# EAGLE design Modulador e Demodulador AM (EAGLE 7.6.0)
CNAME: Principios de Telecomunicacao; CREVISION: REV1; DESIGNER: F. Carrion, M. Silva
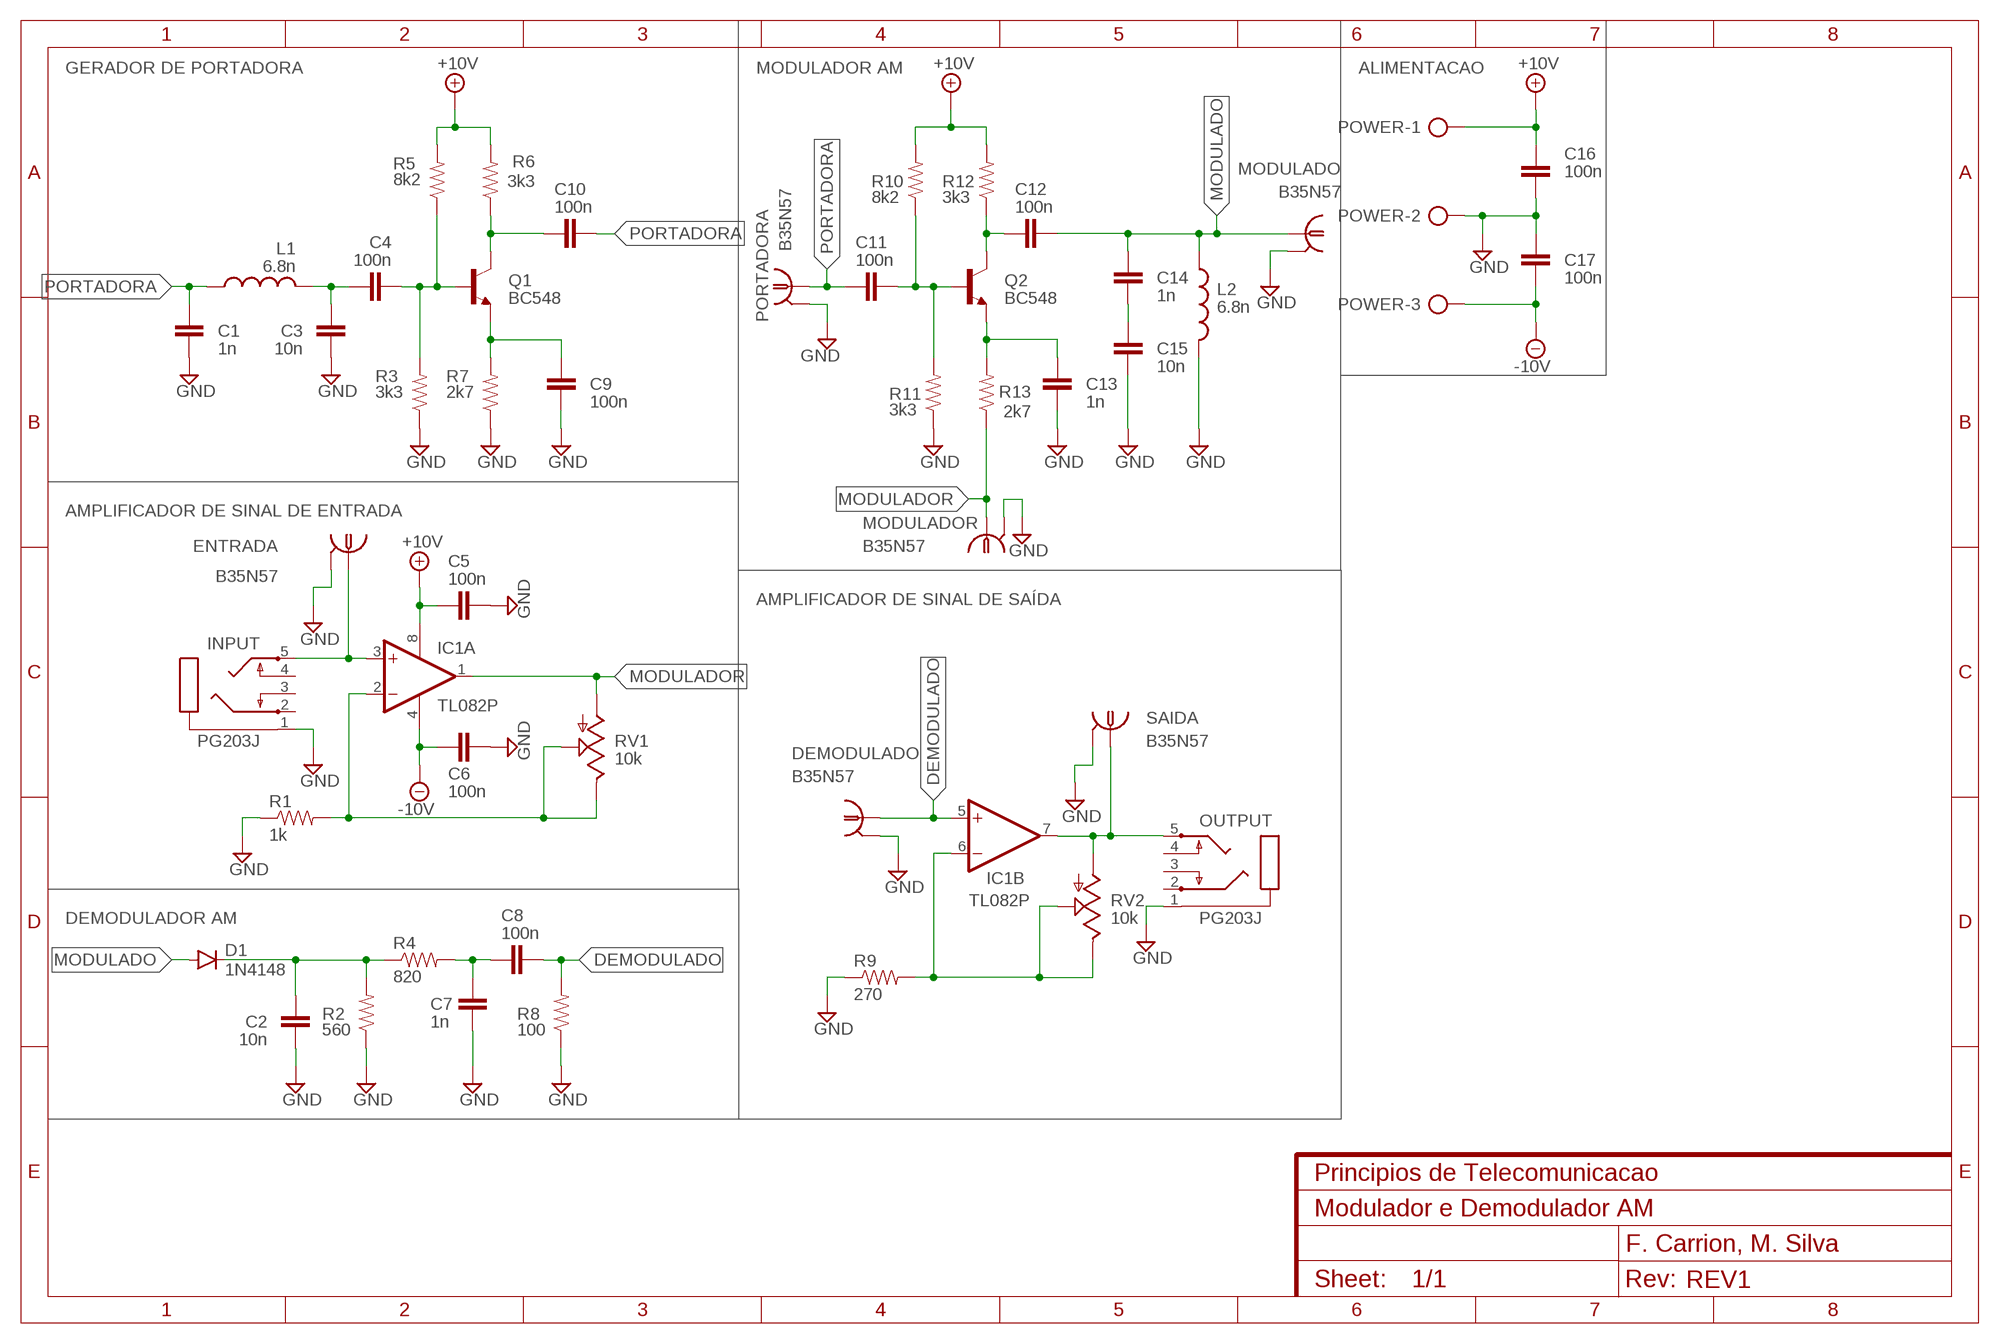
[diagram p0: schematic, sheet 1]

## Parts
C1  1n  CAPPTH2  [CAP-PTH-SMALL2]
C2  10n  CAPPTH2  [CAP-PTH-SMALL2]
C3  10n  CAPPTH2  [CAP-PTH-SMALL2]
C4  100n  CAPPTH2  [CAP-PTH-SMALL2]
C5  100n  CAPPTH2  [CAP-PTH-SMALL2]
C6  100n  CAPPTH2  [CAP-PTH-SMALL2]
C7  1n  CAPPTH2  [CAP-PTH-SMALL2]
C8  100n  CAPPTH2  [CAP-PTH-SMALL2]
C9  100n  CAPPTH2  [CAP-PTH-SMALL2]
C10  100n  CAPPTH2  [CAP-PTH-SMALL2]
C11  100n  CAPPTH2  [CAP-PTH-SMALL2]
C12  100n  CAPPTH2  [CAP-PTH-SMALL2]
C13  1n  CAPPTH2  [CAP-PTH-SMALL2]
C14  1n  CAPPTH2  [CAP-PTH-SMALL2]
C15  10n  CAPPTH2  [CAP-PTH-SMALL2]
C16  100n  CAPPTH2  [CAP-PTH-SMALL2]
C17  100n  CAPPTH2  [CAP-PTH-SMALL2]
D1  1N4148  DIODE1N4148  [DIODE-1N4148]
DEMODULADO  B35N57  [B35N57]
ENTRADA  B35N57  [B35N57]
IC1  TL082P  [DIL08]
INPUT  PG203J  [PG203J]
L1  6.8n  L-US0207/10  [0207/10]
L2  6.8n  L-US0207/10  [0207/10]
MODULADO  B35N57  [B35N57]
MODULADOR  B35N57  [B35N57]
OUTPUT  PG203J  [PG203J]
PORTADORA  B35N57  [B35N57]
POWER  AK500/3-H  [AK500/3-H]
Q1  BC548  [TO92-EBC]
Q2  BC548  [TO92-EBC]
R1  1k  RESISTORAXIAL-0.3  [AXIAL-0.3]
R2  560  RESISTORAXIAL-0.3  [AXIAL-0.3]
R3  3k3  RESISTORAXIAL-0.3  [AXIAL-0.3]
R4  820  RESISTORAXIAL-0.3  [AXIAL-0.3]
R5  8k2  RESISTORAXIAL-0.3  [AXIAL-0.3]
R6  3k3  RESISTORAXIAL-0.3  [AXIAL-0.3]
R7  2k7  RESISTORAXIAL-0.3  [AXIAL-0.3]
R8  100  RESISTORAXIAL-0.3  [AXIAL-0.3]
R9  270  RESISTORAXIAL-0.3  [AXIAL-0.3]
R10  8k2  RESISTORAXIAL-0.3  [AXIAL-0.3]
R11  3k3  RESISTORAXIAL-0.3  [AXIAL-0.3]
R12  3k3  RESISTORAXIAL-0.3  [AXIAL-0.3]
R13  2k7  RESISTORAXIAL-0.3  [AXIAL-0.3]
RV1  10k  POT-RV16AF-20  [POT_ALPHA_RV16AF-20]
RV2  10k  POT-RV16AF-20  [POT_ALPHA_RV16AF-20]
SAIDA  B35N57  [B35N57]

## Nets
+10V: C5.1 C16.1 IC1.8(P:V+) POWER.1 R5.P$2 R6.P$2 R10.P$2 R12.P$2
-10V: C6.1 C17.2 IC1.4(P:V-) POWER.3
DEMODULADO: C8.2 DEMODULADO.1 IC1.5(B:+IN) R8.P$2
GND: C1.2 C2.2 C3.2 C5.2 C6.2 C7.2 C9.2 C13.2 C15.2 C16.2 C17.1 DEMODULADO.2 DEMODULADO.3 DEMODULADO.4 DEMODULADO.5 ENTRADA.2 ENTRADA.3 ENTRADA.4 ENTRADA.5 INPUT.1 L2.2 MODULADO.2 MODULADO.3 MODULADO.4 MODULADO.5 MODULADOR.2 MODULADOR.3 MODULADOR.4 MODULADOR.5 OUTPUT.1 PORTADORA.2 PORTADORA.3 PORTADORA.4 PORTADORA.5 POWER.2 R1.P$1 R2.P$1 R3.P$1 R7.P$1 R8.P$1 R9.P$1 R11.P$1 SAIDA.2 SAIDA.3 SAIDA.4 SAIDA.5
MODULADO: C12.2 C14.1 D1.A L2.1 MODULADO.1
MODULADOR: IC1.1(A:OUT) MODULADOR.1 R13.P$1 RV1.1(A)
N$1: C11.2 Q2.B R10.P$1 R11.P$2
N$2: IC1.2(A:-IN) R1.P$2 RV1.2(S) RV1.3(E)
N$3: C9.1 Q1.E R7.P$2
N$4: C4.2 Q1.B R3.P$2 R5.P$1
N$5: C10.1 Q1.C R6.P$1
N$6: IC1.6(B:-IN) R9.P$2 RV2.2(S) RV2.3(E)
N$7: C12.1 Q2.C R12.P$1
N$8: ENTRADA.1 IC1.3(A:+IN) INPUT.5
N$9: C13.1 Q2.E R13.P$2
N$10: C3.1 C4.1 L1.2
N$11: C14.2 C15.1
N$12: C2.1 D1.C R2.P$2 R4.P$1
N$13: C7.1 C8.1 R4.P$2
N$15: IC1.7(B:OUT) OUTPUT.5 RV2.1(A) SAIDA.1
PORTADORA: C1.1 C10.2 C11.1 L1.1 PORTADORA.1
Unconnected: INPUT.2 INPUT.3 INPUT.4 OUTPUT.2 OUTPUT.3 OUTPUT.4

## Notes on the sheet
- GERADOR DE PORTADORA | MODULADOR AM | ALIMENTACAO
- AMPLIFICADOR DE SINAL DE ENTRADA
- AMPLIFICADOR DE SINAL DE SAÍDA
- DEMODULADOR AM

## Library data of the parts
C1-C17 = SparkFun-Capacitors:CAP: Capacitor Standard 0603 ceramic capacitor, and 0.1" leaded capacitor.
D1 = SparkFun-DiscreteSemi:DIODE: Diode These are standard reverse protection diodes and small signal diodes. SMA package can handle up to about 1A. SOD-323 can handle about 200mA. What the SOD-323 package when ordering, there are some mfgs out there that are 5-pin packages.; PROD_ID: DIO-08378
DEMODULADO ENTRADA MODULADO MODULADOR PORTADORA SAIDA = con-coax:B35N57: BNC CONNECTOR M/A COM www.macom.com; OC_FARNELL: unknown; OC_NEWARK: unknown
IC1 = linear:TL082: OP AMP Data sheet <http://www.ti.com/lit/ds/symlink/tl084a . pdf>; DATA_SHEET: <a href="http://www.ti.com/lit/ds/symlink/tl084a.pdf"> Data sheet </a>
INPUT OUTPUT = con-hirschmann:PG203J: MIC/HEADPHONE JACK KS-S stereo microphone/headphone jack PG203JN (Schukat); OC_FARNELL: unknown; OC_NEWARK: unknown
L1 L2 = resistor:L-US: INDUCTOR, American symbol
POWER = con-ptr500:AK500/3-H: CONNECTOR Aug. 2004 / PTR Meßtechnik: Die Bezeichnung der Serie AK505 wurde geändert. Es handelt sich hierbei um AK500 in horizontaler Ausführung.; OC_FARNELL: unknown; OC_NEWARK: unknown
Q1 Q2 = transistor-npn:BC548*: NPN Transistor
R1-R13 = SparkFun-Resistors:RESISTOR: Resistor Basic schematic elements and footprints for 0603, 1206, and PTH resistors.
RV1 RV2 = SparkFun-Electromechanical:POT

## Board
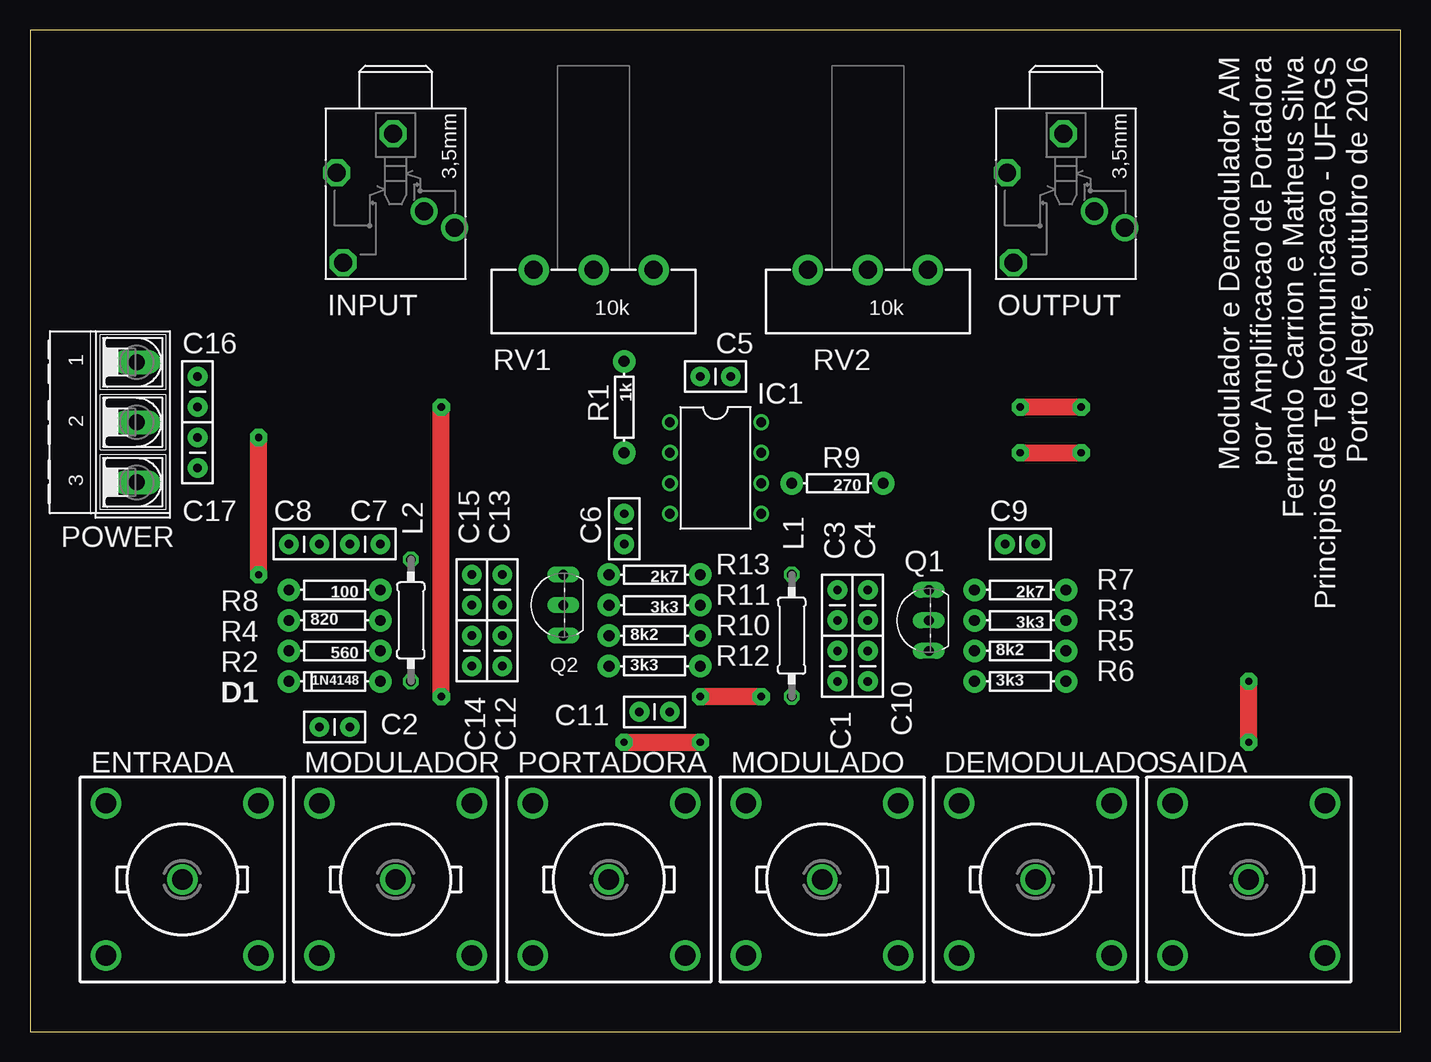
[diagram p1: board, top side]
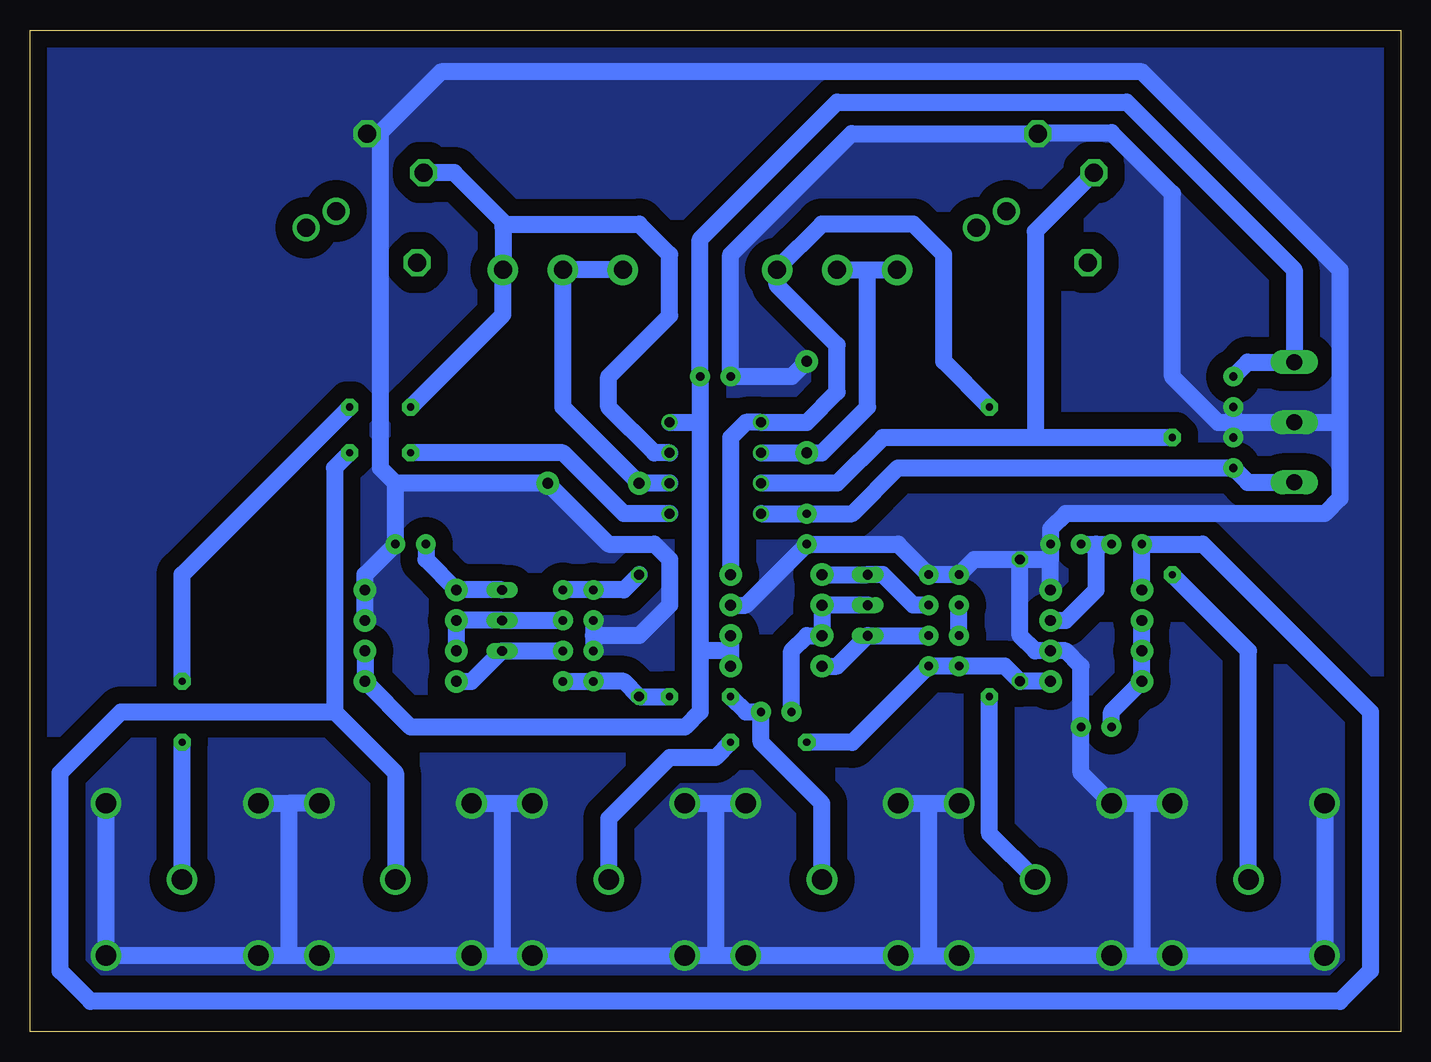
[diagram p2: board, bottom side, seen from below]

Size 114.28 x 83.49 mm. Coordinates in mm from the lower left corner, seen from the top.
Outline: 0,0 114.28,0 114.28,83.49 0,83.49 0,0
Copper layers (1*16): Top 0.035mm / dielectric 1.5mm / Bottom 0.035mm
Design rules "default": minimum track width 10mil, minimum drill 24mil, track to track 8mil, track to pad 8mil, pad to pad 8mil, via to via 8mil, smd to smd 8mil, copper to edge 40mil, drill to drill 8mil, minimum pad ring 10mil, minimum via ring 8mil, stop-mask expansion 4mil, vias tented up to drill 0mil, thermal gap 10mil

### Footprints (pad centres in the part's own frame; a part is rotated, then mirrored left to right if it is on the bottom)
CAP-PTH-SMALL2 = drill 0.7 pad 1.651: 1 0,0; 2 2.54,0
DIODE-1N4148 = drill 0.9 pad 1.88: A -3.81,0; C 3.81,0
B35N57 = drill 1.7: 1 0,0; 2 6.35,6.35; 3 -6.35,6.35; 4 -6.35,-6.35; 5 6.35,-6.35
DIL08 = drill 0.813 pad 1.27: 1 -3.81,-3.81; 2 -1.27,-3.81; 3 1.27,-3.81; 4 3.81,-3.81; 5 3.81,3.81; 6 1.27,3.81; 7 -1.27,3.81; 8 -3.81,3.81
PG203J = drill 1.499 octagon: 1 -5.004,-0.203; 4 5.74,-4.369; 5 -1.753,-4.902 | drill 1.499: 2 2.845,4.902; 3 1.448,2.388
0207/10 = drill 0.813 octagon: 1 -5.08,0; 2 5.08,0
AK500/3-H = drill 1.321 long: 1 -5.004,0; 2 0,0; 3 5.004,0
TO92-EBC = drill 0.813 long: B 0,-1.27; C -2.54,-1.27; E 2.54,-1.27
AXIAL-0.3 = drill 0.9 pad 1.88: P$1 -3.81,0; P$2 3.81,0
POT_ALPHA_RV16AF-20 = drill 1.5 pad 2.54: 1 -5,0; 2 0,0; 3 5,0

### Placement (x,y rotation side)
C1  67.31,29.21 90 top
C2  24.13,25.4 0 top
C3  67.31,36.83 270 top
C4  69.85,36.83 270 top
C5  58.42,54.61 180 top
C6  49.53,43.18 270 top
C7  26.67,40.64 0 top
C8  24.13,40.64 180 top
C9  81.28,40.64 0 top
C10  69.85,31.75 270 top
C11  53.34,26.67 180 top
C12  39.37,33.02 270 top
C13  39.37,35.56 90 top
C14  36.83,30.48 90 top
C15  36.83,35.56 90 top
C16  13.97,54.61 270 top
C17  13.97,49.53 270 top
D1  25.4,29.21 180 top
DEMODULADO  83.82,12.7 0 top
ENTRADA  12.7,12.7 0 top
IC1  57.15,46.99 270 top
INPUT  30.48,69.85 270 top
L1  63.5,33.02 90 top
L2  31.75,34.29 90 top
MODULADO  66.04,12.7 0 top
MODULADOR  30.48,12.7 0 top
OUTPUT  86.36,69.85 270 top
PORTADORA  48.26,12.7 0 top
POWER  8.89,50.8 270 top
Q1  73.66,34.29 90 top
Q2  43.18,35.56 90 top
R1  49.53,52.07 270 top
R2  25.4,31.75 180 top
R3  82.55,34.29 180 top
R4  25.4,34.29 0 top
R5  82.55,31.75 0 top
R6  82.55,29.21 0 top
R7  82.55,36.83 180 top
R8  25.4,36.83 180 top
R9  67.31,45.72 180 top
R10  52.07,33.02 0 top
R11  52.07,35.56 180 top
R12  52.07,30.48 0 top
R13  52.07,38.1 180 top
RV1  46.99,63.5 180 top
RV2  69.85,63.5 180 top
SAIDA  101.6,12.7 0 top

### Tracks (layer width: path | path; a pad name or v marks a point on that pad's centre or on a via)
+10V
  Bottom 1.422: R5.P$2 R6.P$2 82.55,25.4 59.69,25.4 58.42,26.67 58.42,31.75 | R10.P$2 55.88,31.75 | 55.88,31.75 R12.P$2 | 58.42,50.8 C5.1 58.42,66.04 46.99,77.47 22.86,77.47 8.89,63.5 POWER.1 12.78,55.8 C16.1 | 58.42,50.8 58.42,31.75 | IC1.8 58.42,50.8 | 55.88,31.75 58.42,31.75
-10V
  Bottom 1.422: IC1.4 C6.1 45.72,43.18 41.91,46.99 C17.2 12.78,45.8 POWER.3
DEMODULADO  (via drill 0.6 pad 1.42)
  Top 1.422: v82.55,48.26 v87.63,48.26
  Bottom 1.422: R8.P$2 C8.2 16.51,40.64 2.54,26.67 2.54,5.08 5.08,2.54 109.22,2.54 111.76,5.08 111.76,21.59 106.68,26.67 88.9,26.67 | IC1.5 64.77,43.18 69.85,48.26 v82.55,48.26 | v87.63,48.26 88.9,46.99 88.9,26.67 | 88.9,26.67 83.82,21.59 DEMODULADO.1
GND
  Bottom 1.422: R1.P$1 50.8,54.61 C5.2 55.88,64.77 45.8,74.85 INPUT.1 30.2,74.93 24.13,74.93 19.05,69.85 19.05,54.61 15.24,50.8 13.97,50.8 | R3.P$1 R7.P$1 86.36,38.1 C9.2 83.82,45.72 | C3.2 67.31,33.02 | 67.31,33.02 C1.2 | R11.P$1 54.61,35.56 C6.2 41.91,40.64 C13.2 C15.2 35.56,39.37 L2.2 | R8.P$1 29.21,39.37 | L2.2 31.75,33.02 30.48,31.75 R2.P$1 27.94,31.75 26.67,30.48 C2.2 26.67,21.59 MODULADOR.3 21.59,19.05 | L2.2 29.21,39.37 | 29.21,39.37 C7.2 29.21,41.91 27.94,43.18 6.35,43.18 5.08,44.45 5.08,50.8 | C16.2 13.97,50.8 | 13.97,50.8 C17.1 | ENTRADA.3 ENTRADA.4 ENTRADA.5 21.59,6.35 | 21.59,6.35 MODULADOR.4 MODULADOR.5 39.37,6.35 | 57.15,6.35 PORTADORA.5 PORTADORA.4 39.37,6.35 | 57.15,6.35 MODULADO.4 MODULADO.5 74.93,6.35 | 74.93,6.35 DEMODULADO.4 DEMODULADO.5 92.71,6.35 | 92.71,6.35 SAIDA.4 SAIDA.5 SAIDA.2 | DEMODULADO.2 92.71,19.05 | 92.71,19.05 92.71,6.35 | SAIDA.3 92.71,19.05 | DEMODULADO.3 74.93,19.05 | 74.93,19.05 74.93,6.35 | 74.93,19.05 MODULADO.2 | MODULADO.3 57.15,19.05 | 57.15,19.05 57.15,6.35 | 57.15,19.05 PORTADORA.2 | PORTADORA.3 39.37,19.05 | 39.37,19.05 39.37,6.35 | 39.37,19.05 MODULADOR.2 | 21.59,19.05 21.59,6.35 | 21.59,19.05 ENTRADA.2 | 67.31,33.02 63.5,33.02 60.96,35.56 60.96,39.37 62.23,40.64 66.04,40.64 R9.P$1 83.82,45.72 | 83.82,45.72 85.09,46.99 85.09,74.93 | 85.09,74.93 80.01,80.01 21.59,80.01 5.08,63.5 5.08,50.8 | OUTPUT.1 86.08,74.93 85.09,74.93 | 5.08,50.8 POWER.2 13.97,50.8
  pour Bottom (isolate 1.422, no thermals): 0,0 0,83.82 114.3,83.82 114.3,0
MODULADO  (via drill 0.6 pad 1.42)
  Top 1.422: v49.53,24.13 v55.88,24.13
  Bottom 1.422: D1.A L2.1 33.02,30.48 C14.1 C12.2 45.72,24.13 v49.53,24.13 | v55.88,24.13 57.15,22.86 60.96,22.86 66.04,17.78 MODULADO.1
MODULADOR  (via drill 0.6 pad 1.42)
  Top 1.422: v34.29,27.94 v34.29,52.07
  Bottom 1.422: R13.P$1 55.88,49.53 54.61,50.8 IC1.1 49.53,50.8 46.99,53.34 46.99,57.23 51.99,62.23 RV1.1 51.99,63.58 48.26,67.31 40.64,67.31 38.1,64.77 38.1,55.88 v34.29,52.07 | MODULADOR.1 34.29,16.51 v34.29,27.94
N$1
  Bottom 1.422: Q2.B R11.P$2 R10.P$1 49.53,33.02 50.8,31.75 C11.2
N$2
  Bottom 1.422: IC1.2 R1.P$2 48.26,48.26 44.45,52.07 44.45,63.5 | RV1.2 44.45,63.5 | 44.45,63.5 RV1.3
N$3
  Bottom 1.422: Q1.E R7.P$2 81.28,39.37 C9.1
N$4
  Bottom 1.422: R5.P$1 R3.P$2 Q1.B C4.2
N$5
  Bottom 1.422: R6.P$1 77.47,29.21 Q1.C C10.1
N$6
  Bottom 1.422: RV2.3 RV2.2 69.85,52.07 R9.P$2 IC1.6
N$7
  Bottom 1.422: R12.P$1 46.99,30.48 Q2.C C12.1
N$8  (via drill 0.6 pad 1.42)
  Top 1.422: v19.05,38.1 v19.05,49.53
  Bottom 1.422: ENTRADA.1 12.7,31.75 v19.05,38.1 | v19.05,49.53 30.48,49.53 | 30.48,49.53 43.18,49.53 46.99,45.72 IC1.3 | INPUT.5 30.48,66.7 30.48,49.53
N$9
  Bottom 1.422: R13.P$2 Q2.E 43.18,38.1 40.64,35.56 C13.1
N$10
  Bottom 1.422: C4.1 C3.1 64.77,36.83 L1.2
N$11
  Bottom 1.422: C14.2 C15.1
N$12
  Bottom 1.422: R4.P$1 R2.P$2 D1.C 24.13,26.67 C2.1
N$13
  Bottom 1.422: C7.1 25.4,40.64 | 25.4,40.64 C8.1 | R4.P$2 27.94,34.29 25.4,36.83 25.4,40.64
N$15  (via drill 0.6 pad 1.42)
  Top 1.422: v101.6,24.13 v101.6,29.21 | v87.63,52.07 v82.55,52.07
  Bottom 1.422: IC1.7 62.23,48.26 66.04,52.07 66.04,54.61 60.96,59.69 60.96,64.77 63.5,67.31 74.62,67.31 | 74.62,67.31 78.92,71.6 OUTPUT.5 | SAIDA.1 v101.6,24.13 | v101.6,29.21 101.6,38.1 v87.63,52.07 | v82.55,52.07 74.85,59.77 RV2.1 74.85,67.08 74.62,67.31
PORTADORA  (via drill 0.6 pad 1.42)
  Top 1.422: v60.96,27.94 v55.88,27.94
  Bottom 1.422: C10.2 C1.1 64.77,29.21 L1.1 v60.96,27.94 | v55.88,27.94 54.61,26.67 C11.1 53.34,24.13 48.26,19.05 PORTADORA.1

### Text on the board
tNames: Modulador e Demodulador AM / por Amplificacao de Portadora / Fernando Carrion e Matheus Silva / Principios de Telecomunicacao - UFRGS / Porto Alegre, outubro de 2016